# EAGLE design 7697_motor_driver_board (EAGLE 7.4.0)
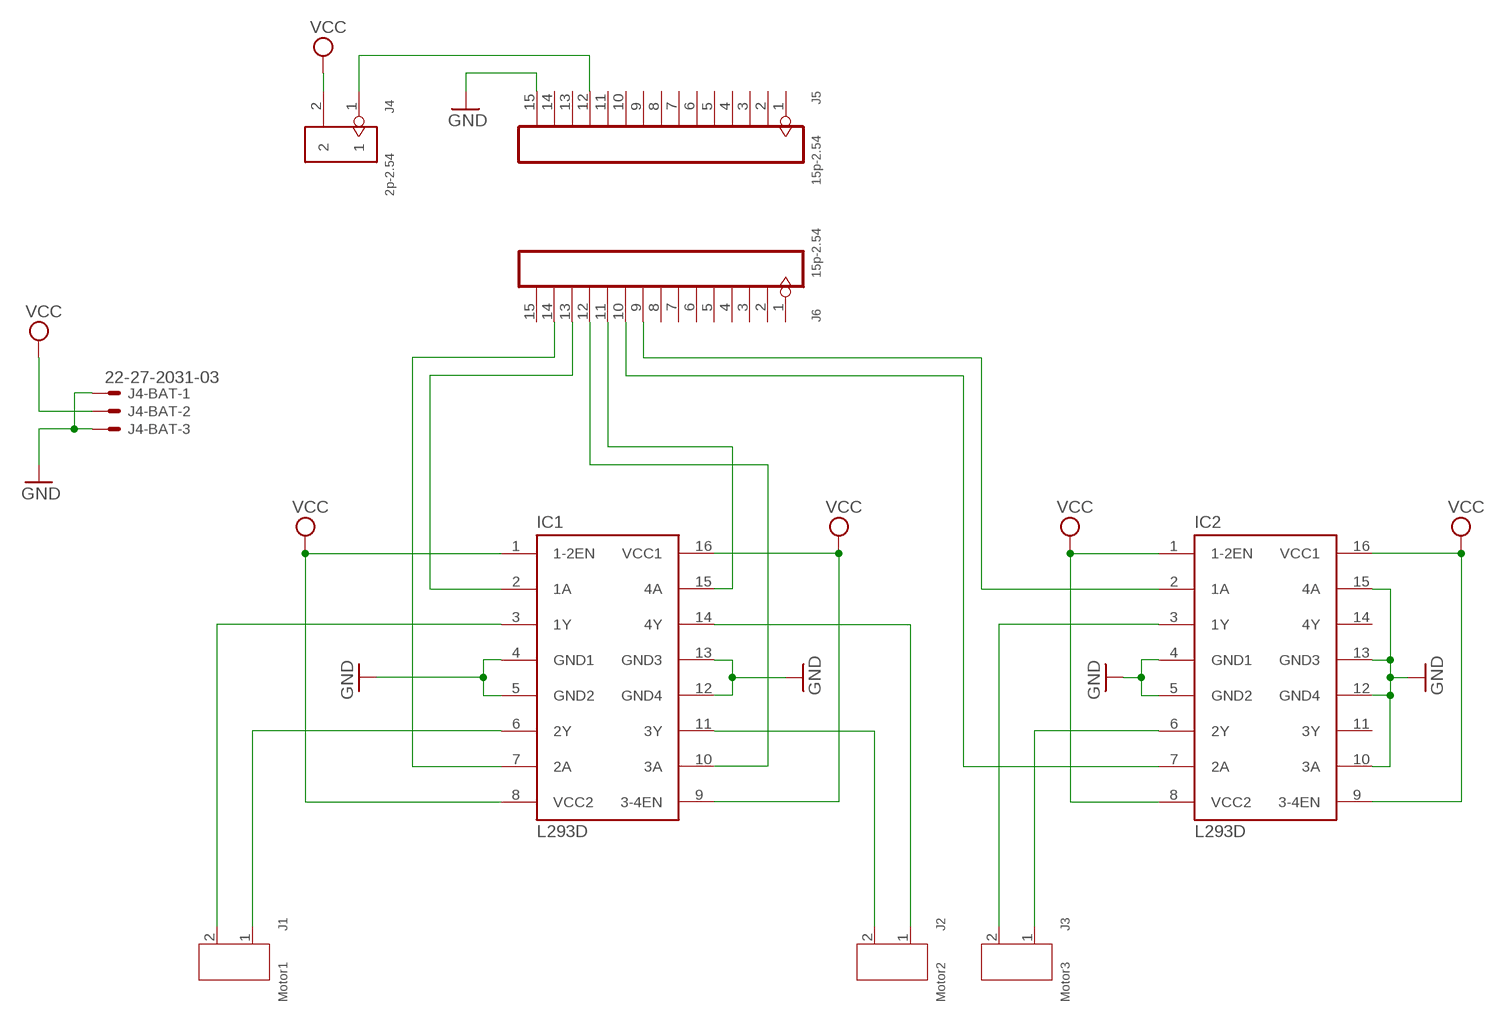
[diagram p0: schematic, sheet 1]

## Parts
IC1  L293D  [DIL16]
IC2  L293D  [DIL16]
J1  Motor1  SCREW-TERMINAL-GREEN(2P-3.5)  [H2-3.5-7.0X7.0MM]
J2  Motor2  SCREW-TERMINAL-GREEN(2P-3.5)  [H2-3.5-7.0X7.0MM]
J3  Motor3  SCREW-TERMINAL-GREEN(2P-3.5)  [H2-3.5-7.0X7.0MM]
J4  2p-2.54  DIP-BLACK-MALE-HEADER-VERT(2P-2.54)  [H2-2.54]
J4-BAT  22-27-2031-03  [6410-03]
J5  15p-2.54  DIP-BLACK-FEMALE-HEADER-VERT(15P-2.54)  [H15-2.54]
J6  15p-2.54  DIP-BLACK-FEMALE-HEADER-VERT(15P-2.54)  [H15-2.54]

## Nets
GND: IC1.4(GND1) IC1.5(GND2) IC1.12(GND4) IC1.13(GND3) IC2.4(GND1) IC2.5(GND2) IC2.10(3A) IC2.12(GND4) IC2.13(GND3) IC2.15(4A) J4-BAT.1 J4-BAT.3 J5.15
N$1 [power]: J4.1 J5.12
N$2: IC1.3(1Y) J1.2
N$3: IC1.6(2Y) J1.1
N$4: IC1.11(3Y) J2.2
N$5: IC1.14(4Y) J2.1
N$6: IC2.3(1Y) J3.2
N$7: IC2.6(2Y) J3.1
N$8 [signal]: IC1.7(2A) J6.14
N$9 [signal]: IC1.2(1A) J6.13
N$10 [signal]: IC1.10(3A) J6.12
N$11 [signal]: IC1.15(4A) J6.11
N$12 [signal]: IC2.7(2A) J6.10
N$13 [signal]: IC2.2(1A) J6.9
VCC [power]: IC1.1(1-2EN) IC1.8(VCC2) IC1.9(3-4EN) IC1.16(VCC1) IC2.1(1-2EN) IC2.8(VCC2) IC2.9(3-4EN) IC2.16(VCC1) J4-BAT.2 J4.2
Unconnected: IC2.11(3Y) IC2.14(4Y) J5.1 J5.2 J5.3 J5.4 J5.5 J5.6 J5.7 J5.8 J5.9 J5.10 J5.11 J5.13 J5.14 J6.1 J6.2 J6.3 J6.4 J6.5 J6.6 J6.7 J6.8 J6.15

## Library data of the parts
IC1 IC2 = st-microelectronics:L293D: PUSH-PULL 4 CHANNEL DRIVER; MPN: L293D; OC_FARNELL: 9589619; OC_NEWARK: 56P8249
J1-J3 = Seeed-OPL-Connector:SCREW-TERMINAL-GREEN(2P-3.5): 320110028; VALUE: GREEN-2P-3.5
J4 = Seeed-OPL-Connector:DIP-BLACK-MALE-HEADER-VERT(2P-2.54): 320020016; MPN: P125-1102A0BS116A1
J4-BAT = con-molex:22-?-03: CONNECTOR wire to board 2.54 mm (.1 inch) pitch header; OC_FARNELL: unknown; OC_NEWARK: unknown
J5 J6 = Seeed-OPL-Connector:DIP-BLACK-FEMALE-HEADER-VERT(15P-2.54): 320030031

## Net classes
0 default: width 0.61 mm, drill 0.61 mm, clearance 0.254 mm
1 signal: width 0.254 mm, drill 0.254 mm, clearance 0.254 mm
2 power: width 1.016 mm, drill 1.016 mm, clearance 0.254 mm

## Board
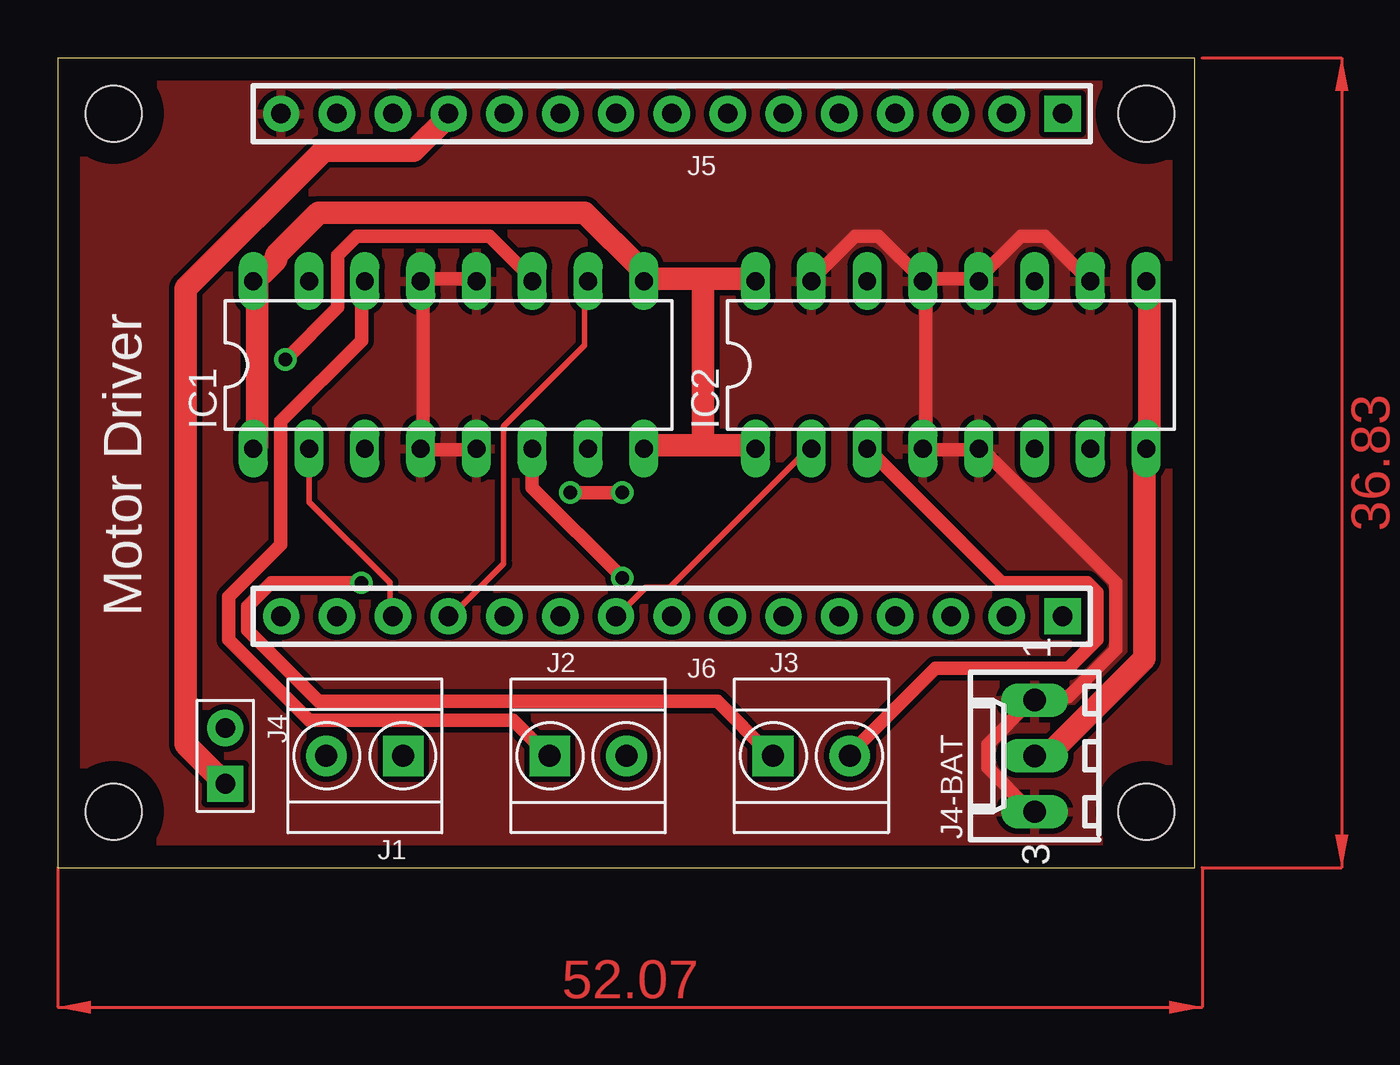
[diagram p1: board, top side]
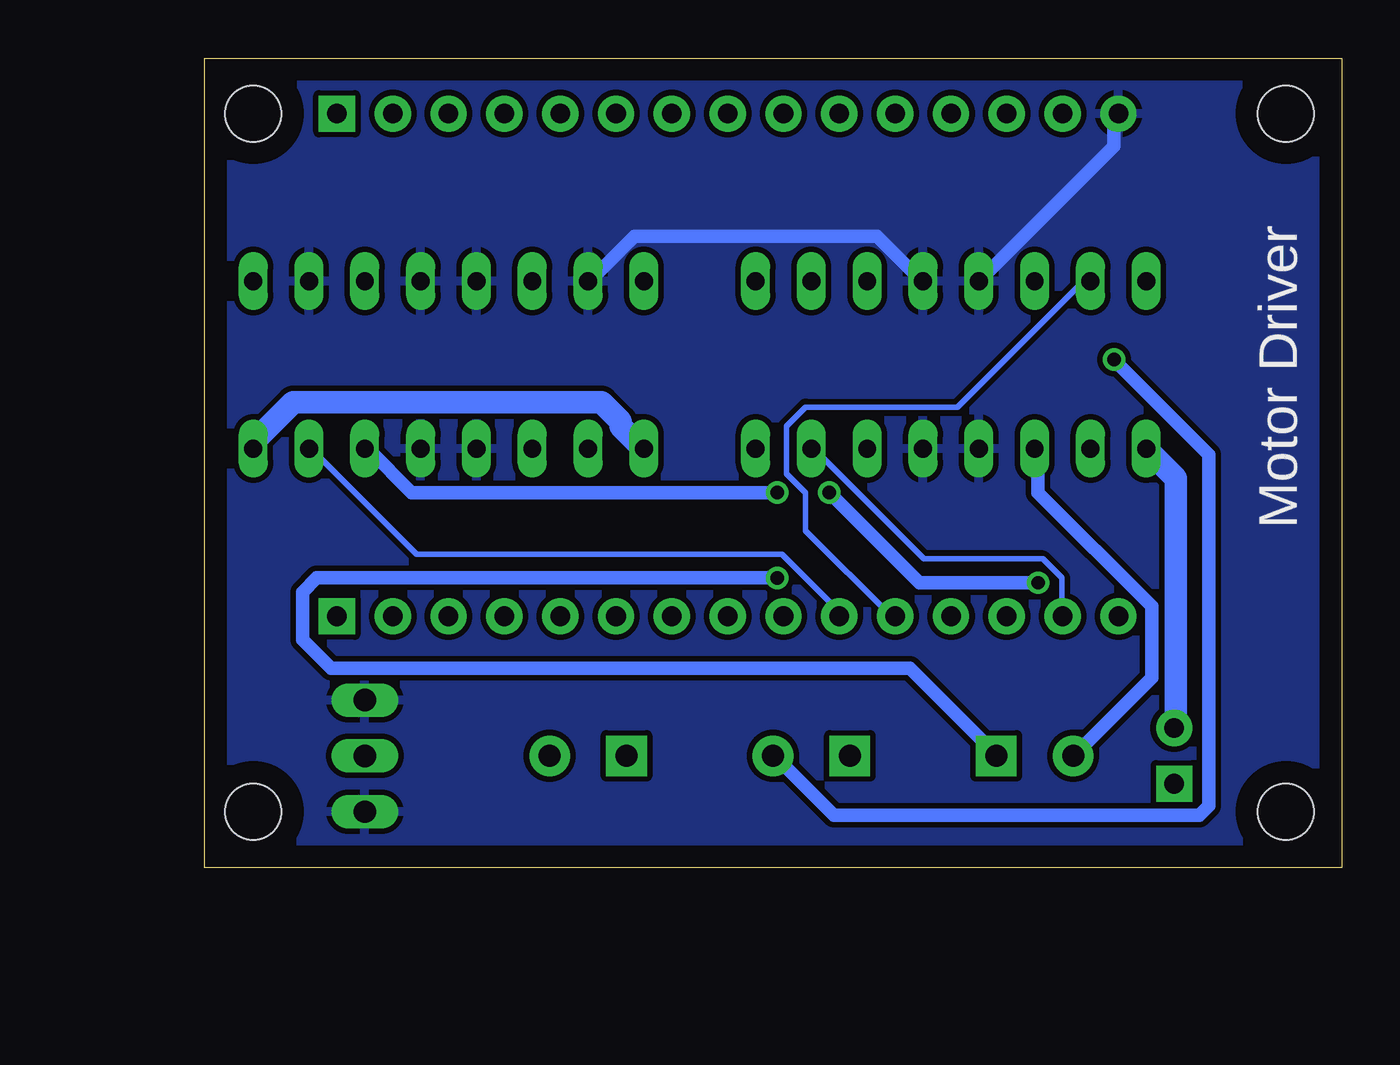
[diagram p2: board, bottom side, seen from below]

Size 51.74 x 36.82 mm. Coordinates in mm from the lower left corner, seen from the top.
Outline: 0,0 51.74,0 51.74,36.82 0,36.82 0,0
Copper layers (1*16): Top 0.035mm / dielectric 1.5mm / Bottom 0.035mm
Design rules "default": minimum track width 10mil, minimum drill 24mil, track to track 8mil, track to pad 8mil, pad to pad 8mil, via to via 8mil, smd to smd 8mil, copper to edge 40mil, drill to drill 8mil, minimum pad ring 10mil, minimum via ring 8mil, stop-mask expansion 4mil, vias tented up to drill 0mil, thermal gap 10mil
Holes 2.54 mm at 2.54,34.29 49.53,34.29 49.53,2.54 2.54,2.54

### Footprints (pad centres in the part's own frame; a part is rotated, then mirrored left to right if it is on the bottom)
DIL16 = drill 0.813 long: 1 -8.89,-3.81; 2 -6.35,-3.81; 3 -3.81,-3.81; 4 -1.27,-3.81; 5 1.27,-3.81; 6 3.81,-3.81; 7 6.35,-3.81; 8 8.89,-3.81; 9 8.89,3.81; 10 6.35,3.81; 11 3.81,3.81; 12 1.27,3.81; 13 -1.27,3.81; 14 -3.81,3.81; 15 -6.35,3.81; 16 -8.89,3.81
H2-3.5-7.0X7.0MM = drill 1 pad 1.85 square: 1 -1.75,0 | drill 1 pad 1.85: 2 1.75,0
H2-2.54 = drill 0.889 pad 1.651 square: 1 0,1.27 | drill 0.889 pad 1.651: 2 0,-1.27
6410-03 = drill 1.016 long: 1 2.54,0; 2 0,0; 3 -2.54,0
H15-2.54 = drill 0.889 pad 1.651 square: 1 0,-17.78 | drill 0.889 pad 1.651: 2 0,-15.24; 3 0,-12.7; 4 0,-10.16; 5 0,-7.62; 6 0,-5.08; 7 0,-2.54; 8 0,0; 9 0,2.54; 10 0,5.08; 11 0,7.62; 12 0,10.16; 13 0,12.7; 14 0,15.24; 15 0,17.78

### Placement (x,y rotation side)
IC1  17.78,22.86 0 top
IC2  40.64,22.86 0 top
J1  13.97,5.08 180 top
J2  24.13,5.08 0 top
J3  34.29,5.08 0 top
J4  7.62,5.08 180 top
J4-BAT  44.45,5.08 90 top
J5  27.94,34.29 90 top
J6  27.94,11.43 90 top

### Tracks (layer width: path | path; a pad name or v marks a point on that pad's centre or on a via)
GND
  Top 0.61: IC1.5 19,19 16.62,19 IC1.4 16.62,19.22 16.62,26.56 IC1.13 16.62,26.77 19,26.77 IC1.12 | J4-BAT.3 44.26,2.59 42.32,4.53 42.32,5.61 44.26,7.56 J4-BAT.1 44.69,7.77 45.99,7.77 48.15,9.93 48.15,12.95 42.1,19 IC2.5 41.88,19 39.51,19 IC2.4 39.51,19.22 39.51,26.56 IC2.13 | IC2.15 34.33,26.77 36.27,28.71 37.35,28.71 39.29,26.77 IC2.13 | IC2.13 39.51,26.77 41.88,26.77 IC2.12 42.1,26.99 43.83,28.71 44.91,28.71 46.85,26.77 IC2.10
  Bottom 0.61: IC1.13 10.36,32.82 10.36,34.11 J5.15 | IC1.12 19.21,26.77 21.16,28.71 32.17,28.71 34.11,26.77 IC2.15
  pour Bottom: 0,36.83 0,0 52.07,0 52.07,36.83
  pour Top: 0,36.83 0,0 52.07,0 52.07,36.83
N$1
  Top 1.016: J4.1 7.56,3.89 5.83,5.61 5.83,26.34 12.09,32.6 16.19,32.6 17.7,34.11 J5.12
N$2
  Bottom 0.61: IC1.3 13.82,19 13.82,17.06 8.64,11.87 8.64,8.64 12.09,5.18 J1.2
N$3  (via drill 0.61)
  Top 0.61: IC1.6 21.59,17.27 v25.69,13.17
  Bottom 0.61: v25.69,13.17 46.63,13.17 47.28,12.52 47.28,10.36 45.99,9.07 19.65,9.07 15.76,5.18 J1.1
N$4  (via drill 0.61)
  Top 0.61: v10.36,23.1 12.74,25.48 12.74,27.85 13.6,28.71 19.65,28.71 21.59,26.77 IC1.11
  Bottom 0.61: v10.36,23.1 6.04,18.78 6.04,2.81 6.48,2.38 23.1,2.38 25.69,4.97 J2.2
N$5
  Top 0.61: IC1.14 13.82,26.56 13.82,23.96 10.15,20.3 10.15,14.68 7.77,12.31 7.77,10.36 11.44,6.69 20.73,6.69 22.24,5.18 J2.1
N$6
  Top 0.61: IC2.3 36.92,19 42.96,12.95 46.85,12.95 47.28,12.52 47.28,10.36 45.99,9.07 39.94,9.07 36.05,5.18 J3.2
N$7  (via drill 0.61)
  Top 0.61: v23.32,17.06 v25.69,17.06 | v13.82,12.95 9.72,12.95 8.64,11.87 8.64,10.8 11.87,7.56 30.01,7.56 32.38,5.18 J3.1
  Bottom 0.61: v25.69,17.06 42.32,17.06 44.26,19 IC2.6 | v23.32,17.06 19.21,12.95 v13.82,12.95
N$8
  Bottom 0.254: IC1.7 23.96,19 19,14.03 13.6,14.03 12.74,13.17 12.74,11.44 J6.14
N$9
  Top 0.254: IC1.2 11.44,19 11.44,16.62 15.11,12.95 15.11,11.44 J6.13
N$10
  Top 0.254: IC1.10 23.96,26.56 23.96,23.75 20.3,20.08 20.3,13.82 17.92,11.44 J6.12
N$11
  Bottom 0.254: IC1.15 11.44,26.56 11.87,26.56 17.49,20.94 24.4,20.94 25.26,20.08 25.26,17.92 24.4,17.06 24.4,15.33 20.51,11.44 J6.11
N$12
  Bottom 0.254: IC2.7 46.85,19 42.1,14.25 25.48,14.25 22.67,11.44 J6.10
N$13
  Top 0.254: IC2.2 34.11,19 27.85,12.74 26.77,12.74 25.48,11.44 J6.9
VCC
  Top 1.016: IC1.1 9.07,19.22 9.07,26.56 IC1.16 9.28,26.99 9.93,27.63 9.93,27.85 11.87,29.79 23.96,29.79 26.56,27.2 IC1.9 26.77,26.77 29.36,26.77 | 29.36,19.22 31.74,19.22 IC2.1 | 29.36,19.22 26.77,19.22 IC1.8 | 29.36,26.77 31.74,26.77 IC2.16 | 29.36,26.77 29.36,19.22 | IC2.9 49.66,26.56 49.66,19.22 IC2.8 49.44,18.57 49.44,9.5 45.12,5.18 44.48,5.18 J4-BAT.2
  Bottom 1.016: J4.2 7.56,6.48 7.56,17.7 8.85,19 IC1.1 | IC2.1 31.95,19.22 32.82,20.08 32.82,20.3 33.68,21.16 47.71,21.16 49.66,19.22 IC2.8
(copper drawn outside any net)
  shapes: Top area x2

### Text on the board
tPlace: Motor Driver
bPlace: Motor Driver